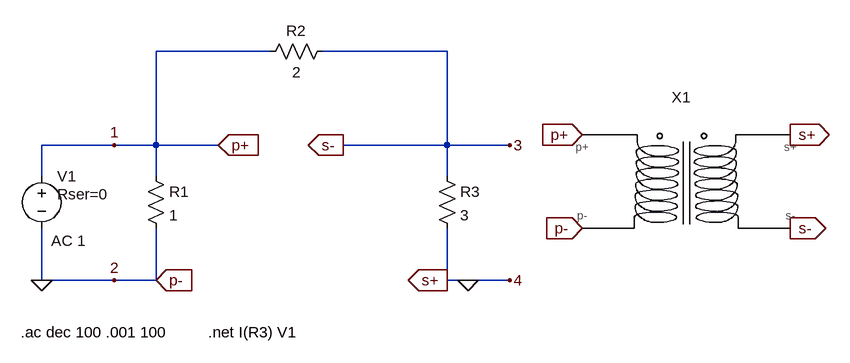
[diagram p0: schematic Ejercicio 1.asc]
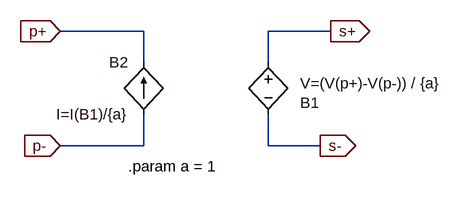
[diagram p1: sub-circuit trafo_ideal.asc]
Ejercicio 1.asc, the LTspice schematic file:
Version 4
SHEET 1 1468 680
WIRE 288 -48 112 -48
WIRE 560 -48 368 -48
WIRE 48 96 -64 96
WIRE 112 96 112 -48
WIRE 112 96 48 96
WIRE 208 96 112 96
WIRE 560 96 560 -48
WIRE 560 96 400 96
WIRE 656 96 560 96
WIRE -64 144 -64 96
WIRE 112 144 112 96
WIRE 560 144 560 96
WIRE -64 304 -64 224
WIRE 48 304 -64 304
WIRE 112 304 112 224
WIRE 112 304 48 304
WIRE 560 304 560 224
WIRE 592 304 560 304
WIRE 656 304 592 304
FLAG 48 96 1
FLAG 48 304 2
FLAG 656 96 3
FLAG 656 304 4
FLAG 768 80 p+
IOPIN 768 80 In
FLAG 768 224 p-
IOPIN 768 224 In
FLAG 1088 80 s+
IOPIN 1088 80 Out
FLAG 1088 224 s-
IOPIN 1088 224 Out
FLAG 592 304 0
FLAG -64 304 0
FLAG 112 304 p-
IOPIN 112 304 In
FLAG 208 96 p+
IOPIN 208 96 In
FLAG 560 304 s+
IOPIN 560 304 Out
FLAG 400 96 s-
IOPIN 400 96 Out
SYMBOL voltage -64 128 R0
WINDOW 123 15 115 Left 2
WINDOW 39 24 44 Left 2
SYMATTR Value2 AC 1
SYMATTR SpiceLine Rser=0
SYMATTR InstName V1
SYMATTR Value ""
SYMBOL res 96 128 R0
SYMATTR InstName R1
SYMATTR Value 1
SYMBOL res 544 128 R0
SYMATTR InstName R3
SYMATTR Value 3
SYMBOL res 384 -64 R90
WINDOW 0 0 56 VBottom 2
WINDOW 3 32 56 VTop 2
SYMATTR InstName R2
SYMATTR Value 2
SYMBOL trafo_ideal 912 144 R0
SYMATTR InstName X1
TEXT -96 384 Left 2 !.ac dec 100 .001 100
TEXT 192 384 Left 2 !.net I(R3) V1

trafo_ideal.asc, the sub-circuit schematic file:
Version 4
SHEET 1 880 680
WIRE -16 80 -144 80
WIRE 272 80 176 80
WIRE -16 128 -16 80
WIRE 176 128 176 80
WIRE -16 256 -16 208
WIRE -16 256 -144 256
WIRE 176 256 176 208
WIRE 256 256 176 256
FLAG 272 80 s+
IOPIN 272 80 Out
FLAG 256 256 s-
IOPIN 256 256 Out
FLAG -144 80 p+
IOPIN -144 80 In
FLAG -144 256 p-
IOPIN -144 256 In
SYMBOL bi -16 208 R180
WINDOW 0 24 80 Left 2
WINDOW 3 24 0 Left 2
SYMATTR InstName B2
SYMATTR Value I=I(B1)/{a}
SYMBOL bv 176 112 R0
WINDOW 3 49 48 Left 2
WINDOW 0 49 78 Left 2
SYMATTR Value V=(V(p+)-V(p-)) / {a}
SYMATTR InstName B1
TEXT -40 288 Left 2 !.param a = 1

The netlist it stands for:
* Ejercicio 1.asc
V1 p+ 0 AC 1 Rser=0
R1 p+ 0 1
R3 s- 0 3
R2 s- p+ 2
XX1 s- 0 p+ 0 trafo_ideal

* block symbol definitions
.subckt trafo_ideal s- s+ p+ p-
B2 p- p+ I=I(B1)/{a}
B1 s+ s- V=(V(p+)-V(p-)) / {a}
.param a = 1
.ends trafo_ideal

.ac dec 100 .001 100
.net I(R3) V1
.backanno
.end